# Altium schematic sheet cSLIM-SA_GPS.SchDoc: cSLIM v1 - GNSS
size A4; SheetNumber: 10; SheetTotal: 12
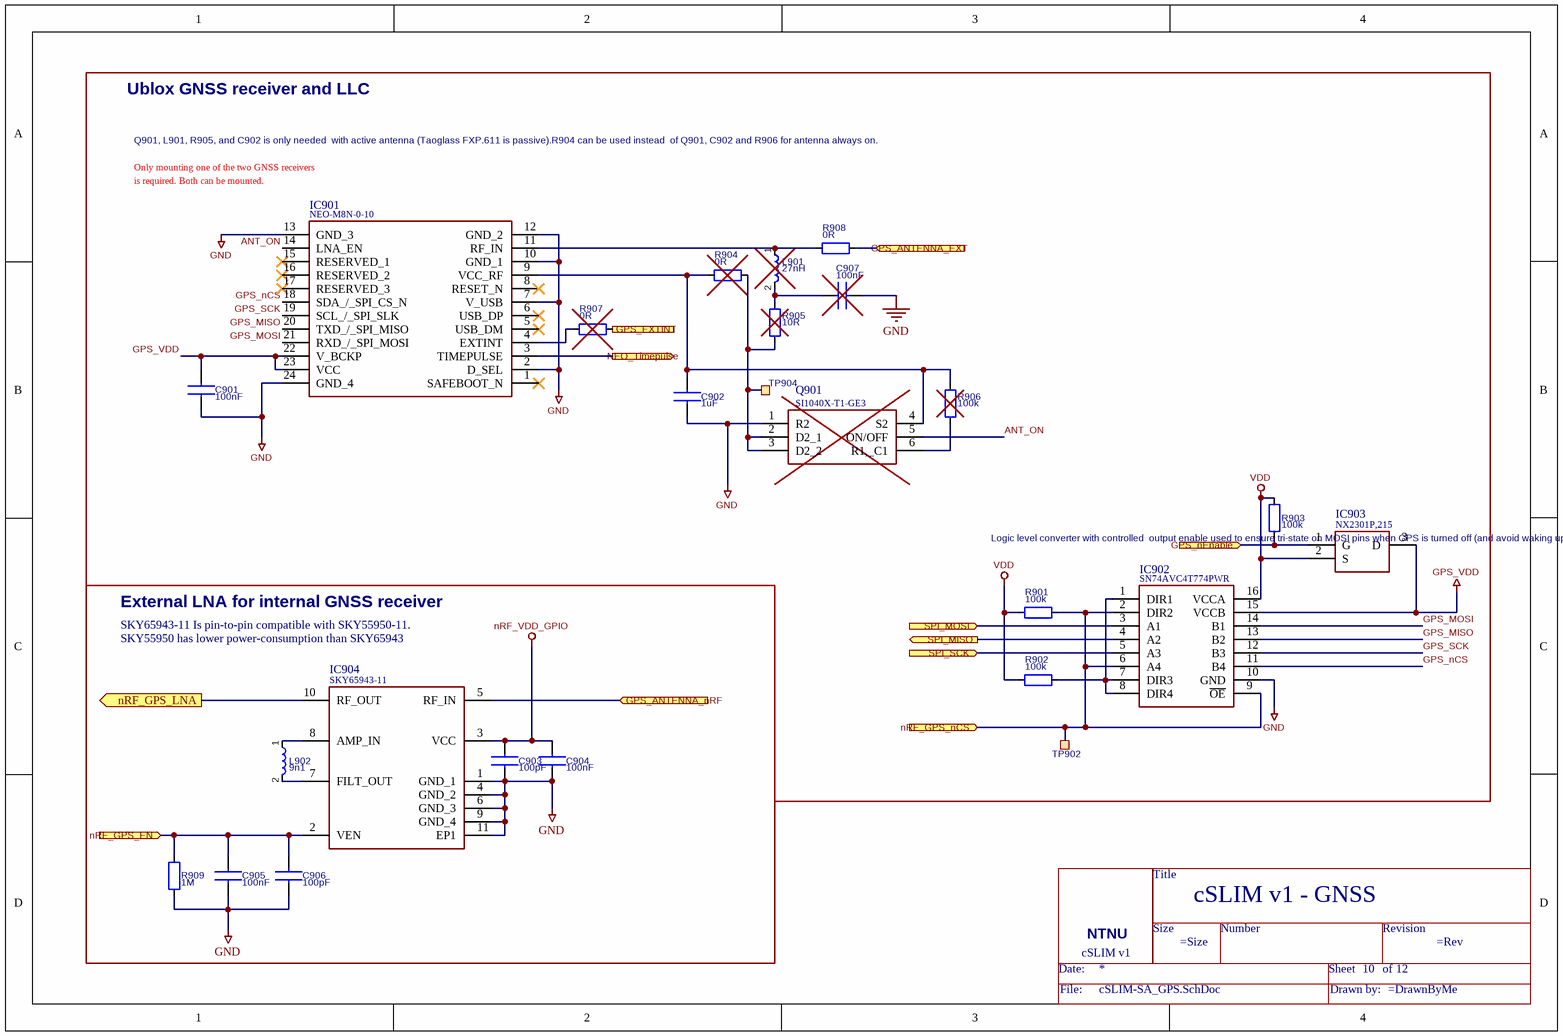
[diagram p0: cSLIM-SA_GPS.SchDoc]

## Parts
=DocumentName  Title_block  (value not drawn)  (no BOM)
C901  100nF  [CAPC1608X90N]
C902  1uF  [CAPC1608X90N]
C903  100pF  [CAPC1608X90N]
C904  100nF  [CAPC1608X90N]
C905  100nF  [CAPC1608X90N]
C906  100pF  [CAPC1608X90N]
C907  100nF  [CAPC1608X90N]
IC901  NEO-M8N-0-10  [NEOM9N00B]
IC902  SN74AVC4T774PWR  [SOP65P640X120-16N]
IC903  NX2301P,215  [SOT95P230X110-3N]
IC904  SKY65943-11  [SKY6594311]
L901  27nH  [L-1608]
L902  9n1  [LQW18AS10NG0CD]
Q901  SI1040X-T1-GE3  [SOTFL50P160X60-6N]
R901  100k  [RESC1608X55N]
R902  100k  [RESC1608X55N]
R903  100k  [RESC1608X55N]
R904  0R  [RESC1608X55N]
R905  10R  [RESC1608X55N]
R906  100k  [RESC1608X55N]
R907  0R  [RESC1608X55N]
R908  0R  [RESC1608X55N]
R909  1M  [RESC1608X55N]
TP902  TP  [TP_SMD_Ø1.0mm]  (value not drawn)  (no BOM)
TP904  TP  [TP_SMD_Ø1.0mm]  (value not drawn)  (no BOM)

## Blocks framed on the sheet
Ublox GNSS receiver and LLC: C901 C902 C907 IC901-IC903 L901 Q901 R901-R908 TP902 TP904
External LNA for internal GNSS receiver: C903-C906 IC904 L902 R909

## Ports
GPS_ANTENNA_EXT (in), GPS_ANTENNA_nRF (in), GPS_EXTINT (out), GPS_nEnable (in), NEO_Timepulse (out), nRF_GPS_EN (in), nRF_GPS_LNA (out), nRF_GPS_nCS (in), SPI_MISO (out), SPI_MOSI (in), SPI_SCK (in)

## Nets
GND: C901.2 C902.2 C903.1 C904.1 C905.1 C906.1 C907.2 IC901.2(D_SEL) IC901.7(V_USB) IC901.10(GND_1) IC901.12(GND_2) IC901.13(GND_3) IC901.24(GND_4) IC902.10(GND) IC904.1(GND_1) IC904.4(GND_2) IC904.6(GND_3) IC904.9(GND_4) IC904.11(EP1) Q901.1(R2) R909.2
GPS_VDD: C901.1 IC901.22(V_BCKP) IC901.23(VCC) IC902.15(VCCB) IC903.3(D)
nRF_VDD_GPIO: C903.2 C904.2 IC904.3(VCC)
VDD: IC902.16(VCCA) IC903.2(S) R901.2 R902.2 R903.2
ANT_ON: IC901.14(LNA_EN) Q901.5(ON/OFF)
GPS_ANTENNA_EXT: R908.1 ; port GPS_ANTENNA_EXT
GPS_ANTENNA_nRF: IC904.5(RF_IN) ; port GPS_ANTENNA_nRF
GPS_EXTINT: R907.2 ; port GPS_EXTINT
GPS_MISO: IC901.20(TXD_/_SPI_MISO) IC902.13(B2)
GPS_MOSI: IC901.21(RXD_/_SPI_MOSI) IC902.14(B1)
GPS_nCS: IC901.18(SDA_/_SPI_CS_N) IC902.11(B4)
GPS_nEnable: IC903.1(G) R903.1 ; port GPS_nEnable
GPS_SCK: IC901.19(SCL_/_SPI_SLK) IC902.12(B3)
NEO_Timepulse: IC901.3(TIMEPULSE) ; port NEO_Timepulse
nRF_GPS_EN: C905.2 C906.2 IC904.2(VEN) R909.1 ; port nRF_GPS_EN
nRF_GPS_LNA: IC904.10(RF_OUT) ; port nRF_GPS_LNA
nRF_GPS_nCS: IC902.2(DIR2) IC902.6(A4) IC902.9(~{OE}) R901.1 TP902.1 ; port nRF_GPS_nCS
SPI_MISO: IC902.4(A2) ; port SPI_MISO
SPI_MOSI: IC902.3(A1) ; port SPI_MOSI
SPI_SCK: IC902.5(A3) ; port SPI_SCK
NetC902_1: C902.1 IC901.9(VCC_RF) Q901.4(S2) R904.2 R906.2
NetC907_1: C907.1 L901.2 R905.2
NetIC901_4: IC901.4(EXTINT) R907.1
NetIC901_11: IC901.11(RF_IN) L901.1 R908.2
NetIC902_1: IC902.1(DIR1) IC902.7(DIR3) IC902.8(DIR4) R902.1
NetIC904_7: IC904.7(FILT_OUT) L902.2
NetIC904_8: IC904.8(AMP_IN) L902.1
NetQ901_2: Q901.2(D2_1) Q901.3(D2_2) R904.1 R905.1 TP904.1
NetQ901_6: Q901.6(R1,_C1) R906.1

Not connected (* = marked no-connect by the designer): IC901 1(SAFEBOOT_N)* 5(USB_DM)* 6(USB_DP)* 8(RESET_N)* 15(RESERVED_1)* 16(RESERVED_2)* 17(RESERVED_3)*

## Notes on the sheet
- Q901, L901, R905, and C902 is only needed
  with active antenna (Taoglass FXP.611 is passive).R904 can be used instead
  of Q901, C902 and R906 for antenna always on.
- Only mounting one of the two GNSS receivers
- (near IC901) is required. Both can be mounted.
- Logic level converter with controlled
  output enable used to ensure tri-state
  on MOSI pins when GPS is turned off
  (and avoid waking up GPS on activity
  on MOSI line as describe by Rundhovde)
- SKY65943-11 Is pin-to-pin compatible with SKY55950-11.
- SKY55950 has lower power-consumption than SKY65943
- 1
- 2
- 3
- 4
- 5
- 6
- A
- B
- C
- Eivind Jølsgard
- D
- Title: cSLIM External GPS
- File: cSLIM_GPS.sch
- Sheet: /
- NTNU
- KiCad E.D.A.  kicad (5.1.4)-1
- Size: A4
- Date: 2021-03-31
- Rev: v1
- Id: 9/11
- (in symbol Title_block) Title; Size; Number; Revision; NTNU; cSLIM v1; Date:; Sheet; of; File:; Drawn by:

## Library data of the parts
C901 C904 C905 = C: Capacitor; Manufacturer_Part_Number: CL10B104KB8NNNL; Fitted: Yes; value: 100nF
C902 = C: Capacitor; Manufacturer_Part_Number: CL10A105KO8NNNC; Fitted: Yes; value: 1uF
C903 C906 = C: Capacitor; Manufacturer_Part_Number: CL10C101JB8NNNC; Fitted: Yes; value: 100pF
C907 = C: Capacitor; Manufacturer_Part_Number: CL10B104KB8NNNL; Fitted: No; value: 100nF
IC901 = NEO-M9N-00B: NEO-M9N-00B should be used if available; Manufacturer_Name: U-Blox; Fitted: Yes; Datasheet Link: https://www.u-blox.com/sites/default/files/NEO-M9N_DataSheet_%28UBX-19014285%29.pdf; Height: 2.6mm; Manufacturer_Part_Number: NEO-M8N-0-10; Mouser Part Number: 377-NEO-M9N-00B; Mouser Price/Stock: https://www.mouser.co.uk/ProductDetail/u-blox/NEO-M9N-00B?qs=DPoM0jnrROVeJ6BHpcwcjw%3D%3D
IC902 = SN74AVC4T774PWR: Logic Level Converter (LLC); Manufacturer_Name: Texas Instruments; Fitted: Yes; Datasheet Link: http://www.ti.com/lit/gpn/sn74avc4t774; Height: 1.2mm; Manufacturer_Part_Number: SN74AVC4T774PWR; Mouser Part Number: 595-SN74AVC4T774PWR; Mouser Price/Stock: https://www.mouser.co.uk/ProductDetail/Texas-Instruments/SN74AVC4T774PWR?qs=WxL8HmPi5r562Eu%2F2kE2LA%3D%3D; Arrow Part Number: SN74AVC4T774PWR; Arrow Price/Stock: https://www.arrow.com/en/products/sn74avc4t774pwr/texas-instruments?region=nac
IC903 = NX2301P,215: P-Channel 20V 2A (Ta) 400mW (Ta), 2.8W (Tc) Surface Mount TO-236AB; Manufacturer_Name: Nexperia; Fitted: Yes; Height: 1.1mm; Mouser Part Number: 771-NX2301P215; Mouser Price/Stock: https://www.mouser.co.uk/ProductDetail/Nexperia/NX2301P215?qs=A1cBxND5mHKs%252BLrxCDENxw%3D%3D; Manufacturer_Part_Number: NX2301P,215; Datasheet Link: http://www.nxp.com/documents/data_sheet/NX2301P.pdf; Arrow Part Number: NX2301P,215; Arrow Price/Stock: https://www.arrow.com/en/products/nx2301p215/nexperia
IC904 = SKY65943-11: GPS LNA MODULE; Manufacturer_Name: Skyworks; Fitted: Yes; Datasheet Link: https://datasheet.datasheetarchive.com/originals/distributors/DKDS41/DSANUWW0028396.pdf; Height: 0.7mm; Manufacturer_Part_Number: SKY65943-11; Mouser Part Number: 873-SKY65943-11; Mouser Price/Stock: https://www.mouser.co.uk/ProductDetail/Skyworks-Solutions-Inc/SKY65943-11?qs=w%2Fv1CP2dgqpnHmrnB1Mkow%3D%3D
L901 = L: Manufacturer_Part_Number: LQG18HH27NJ00D; Fitted: No; value: 27nH
L902 = L_1: Manufacturer_Part_Number: LQW18AN9N1D00D; Fitted: Yes; value: 9n1
Q901 = SI1040X-T1-GE3: IC PWR SWITCH P-CHAN 1:1 SC89-6; Manufacturer_Name: Vishay; Fitted: No; Datasheet Link: https://www.vishay.com/docs/71809/si1040x.pdf; Height: 0.6mm; Manufacturer_Part_Number: SI1040X-T1-GE3; Mouser Part Number: 781-SI1040X-T1-GE3; Mouser Price/Stock: https://www.mouser.co.uk/ProductDetail/Vishay-Semiconductors/SI1040X-T1-GE3?qs=tWM4QuTcS4WRJw%2FdSgdX6Q%3D%3D; Arrow Part Number: SI1040X-T1-GE3; Arrow Price/Stock: https://www.arrow.com/en/products/si1040x-t1-ge3/vishay
R901-R903 R906 = R: Manufacturer_Part_Number: RC0603FR-07100KL; Fitted: Yes; value: 100k
R904 R907 = R: Manufacturer_Part_Number: YJP1608-R001; Fitted: No; value: 0R
R905 = R: Manufacturer_Part_Number: RC0603FR-1310RL; Fitted: Yes; value: 10R
R908 = R: Manufacturer_Part_Number: YJP1608-R001; Fitted: Yes; value: 0R
R909 = R: Manufacturer_Part_Number: RC0603FR-131ML; Fitted: Yes; value: 1M
TP902 TP904 = TP: Test points